# EAGLE design working (EAGLE 9.5.0)
COMPANY: ADAFRUIT INDUSTRIES; DRAWN: KTOWN; REV: A
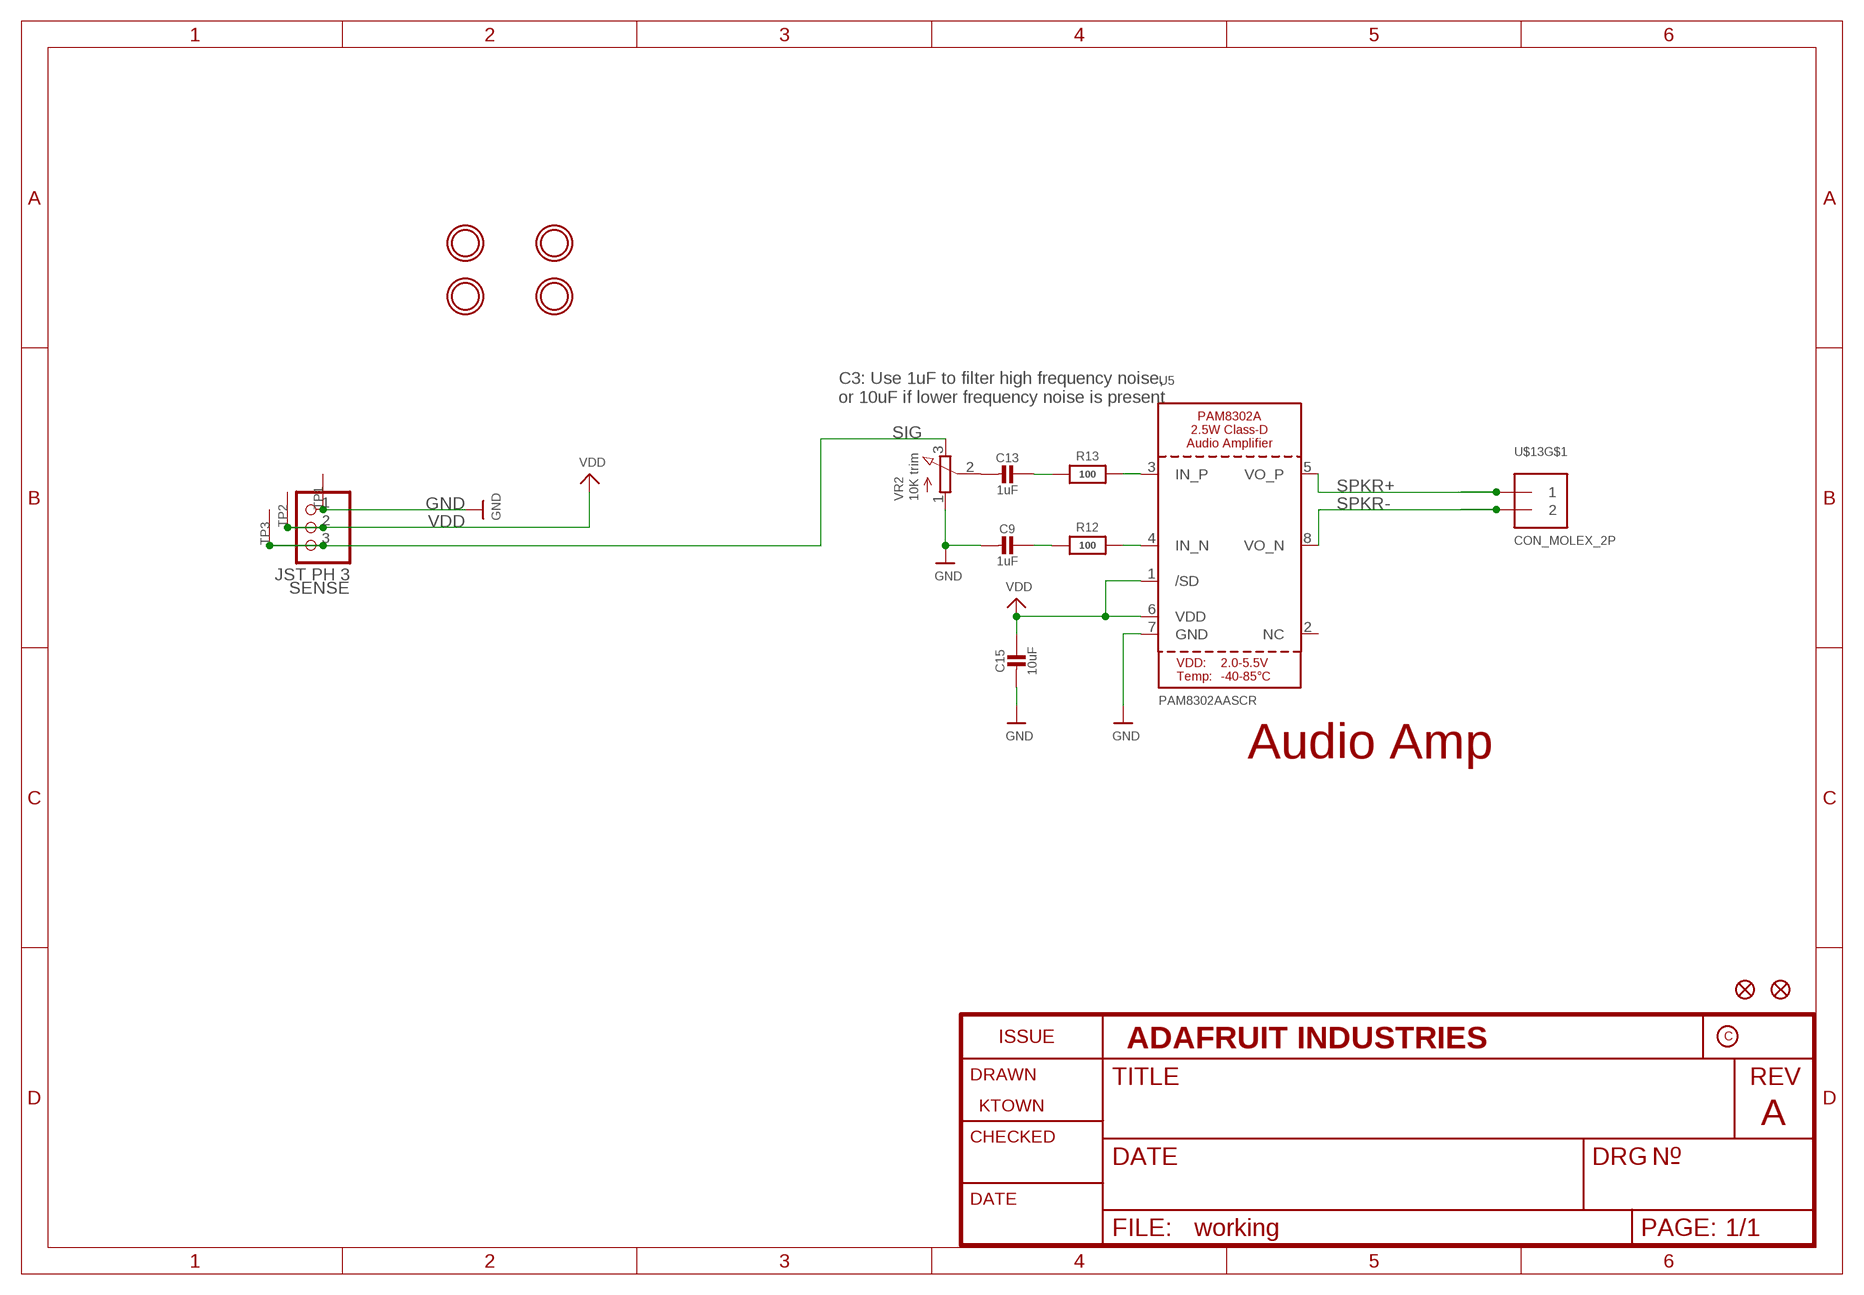
[diagram p0: schematic, sheet 1]

## Parts
C9  1uF  CAP_CERAMIC0603_NO  [0603-NO]
C13  1uF  CAP_CERAMIC0603_NO  [0603-NO]
C15  10uF  CAP_CERAMIC0805-NOOUTLINE  [0805-NO]
FID1  FIDUCIAL_1MM  [FIDUCIAL_1MM]
FID2  FIDUCIAL_1MM  [FIDUCIAL_1MM]
R12  100  RESISTOR_0603_NOOUT  [0603-NO]
R13  100  RESISTOR_0603_NOOUT  [0603-NO]
SENSE  JST PH 3  CON_JST_PH_3PIN  [JSTPH3]
TP1  SEWTAPPCB_ALLIGATOR  [PCB_ALLI]
TP2  SEWTAPPCB_ALLIGATOR  [PCB_ALLI]
TP3  SEWTAPPCB_ALLIGATOR  [PCB_ALLI]
U5  PAM8302AASCR  AUDIOAMP_PAM8302A  [MSOP8_0.65MM]
U$9  MOUNTINGHOLE2.0  [MOUNTINGHOLE_2.0_PLATED]
U$10  MOUNTINGHOLE2.0  [MOUNTINGHOLE_2.0_PLATED]
U$11  MOUNTINGHOLE2.0  [MOUNTINGHOLE_2.0_PLATED]
U$12  MOUNTINGHOLE2.0  [MOUNTINGHOLE_2.0_PLATED]
U$13  CON_MOLEX_2P  [53398-0271]
VR2  10K trim  TRIMPOT3303W/X  [TRIMPOT_BOURNS_3303W]

## Nets
GND: C9.2 C15.2 SENSE.1 TP1.P$1(SEW) U5.7(GND) VR2.1(A)
N$19: R12.2 U5.4(IN_N)
N$20: R13.2 U5.3(IN_P)
N$21: C9.1 R12.1
N$22: C13.1 R13.1
N$23: C13.2 VR2.2(S)
SIG: SENSE.3 TP3.P$1(SEW) VR2.3(E)
SPKR+: U5.5(VO_P) U$13.1
SPKR-: U5.8(VO_N) U$13.2
VDD: C15.1 SENSE.2 TP2.P$1(SEW) U5.1(/SD) U5.6(VDD)
Unconnected: U5.2(NC) U$13.M1(MT) U$13.M2(MT)

## Notes on the sheet
- C3: Use 1uF to filter high frequency noise,
  or 10uF if lower frequency noise is present
- Audio Amp

## Library data of the parts
C9 C13 C15 = microbuilder:CAP_CERAMIC: Ceramic Capacitors For new designs, use the packages preceded by an '_' character since they are more reliable: The following footprints should be used on most boards: _0402 - Standard footprint for regular board layouts _0603 - Standard footprint for regular board layouts _0805 - Standard footprint for regular board layouts _1206 - Standard footprint for regular board layouts For extremely tight-pitch boards where space is at a premium, the following 'micro-pitch' footprints can be used (smaller pads, no silkscreen outline, etc.): _0402MP - Micro-pitch footprint for very dense/compact boards _0603MP - Micro-pitch footprint for very dense/compact boards _0805MP - Micro-pitch footprint for very dense/compact boards _1206MP - Micro-pitch footprint for very dense/compact boards
FID1 FID2 = microbuilder:FIDUCIAL: Fiducial Alignment Points Various fiducial points for machine vision alignment.; BOM: EXCLUDE
R12 R13 = microbuilder:RESISTOR: Resistors For new designs, use the packages preceded by an '_' character since they are more reliable: The following footprints should be used on most boards: _0402 - Standard footprint for regular board layouts _0603 - Standard footprint for regular board layouts _0805 - Standard footprint for regular board layouts _1206 - Standard footprint for regular board layouts For extremely tight-pitch boards where space is at a premium, the following 'micro-pitch' footprints can be used (smaller pads, no silkscreen outline, etc.): _0402MP - Micro-pitch footprint for very dense/compact boards _0603MP - Micro-pitch footprint for very dense/compact boards _0805MP - Micro-pitch footprint for very dense/compact boards _1206MP - Micro-pitch footprint for very dense/compact boards
SENSE = microbuilder:CON_JST_PH_3PIN
TP1-TP3 = microbuilder:SEWTAP
U5 = microbuilder:AUDIOAMP_PAM8302A: PAM8302A - 2.5W Class-D Mono Audio Amplifier MSOP8 = PAM8302AASCR
U$9-U$12 = microbuilder:MOUNTINGHOLE: Mounting Hole For #2 screws (0.086"/2.18mm width, 0.094"/2.4mm hole) use 2.5mm; BOM: EXCLUDE
U$13 = microbuilder:CON_MOLEX_2P
VR2 = microbuilder:TRIMPOT: 3-Pin SMT Trimpots Bourns TC33 (X-2) Series 1K - Digikey: TC33X-102ECT-ND 10K - Digikey: TC33X-2-103E 100K - Digikey: TC33X-104ECT-ND Bourns 3303 (W) Series 3mm 10K Single Turn - Digikey: 3303W-103ETR-ND 3mm 100K Single Turn - Digikey: 3303X-104ETR-ND

## Net classes
1 power: width 0.305 mm

## Board
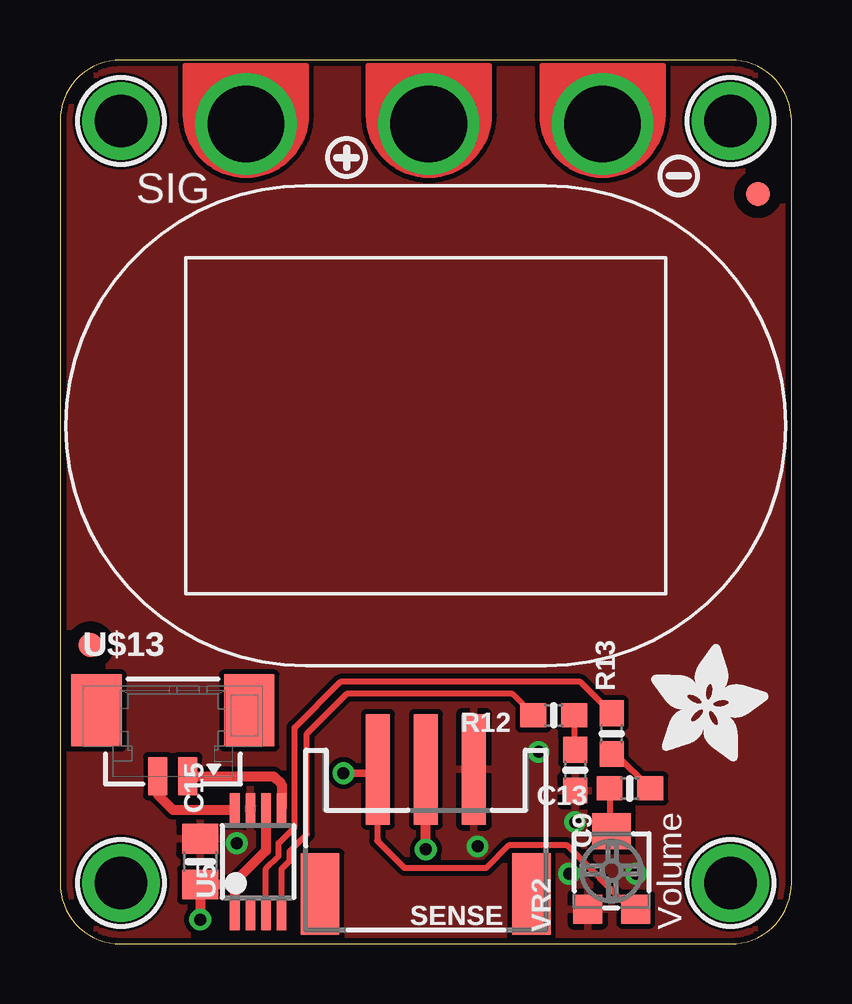
[diagram p1: board, top side]
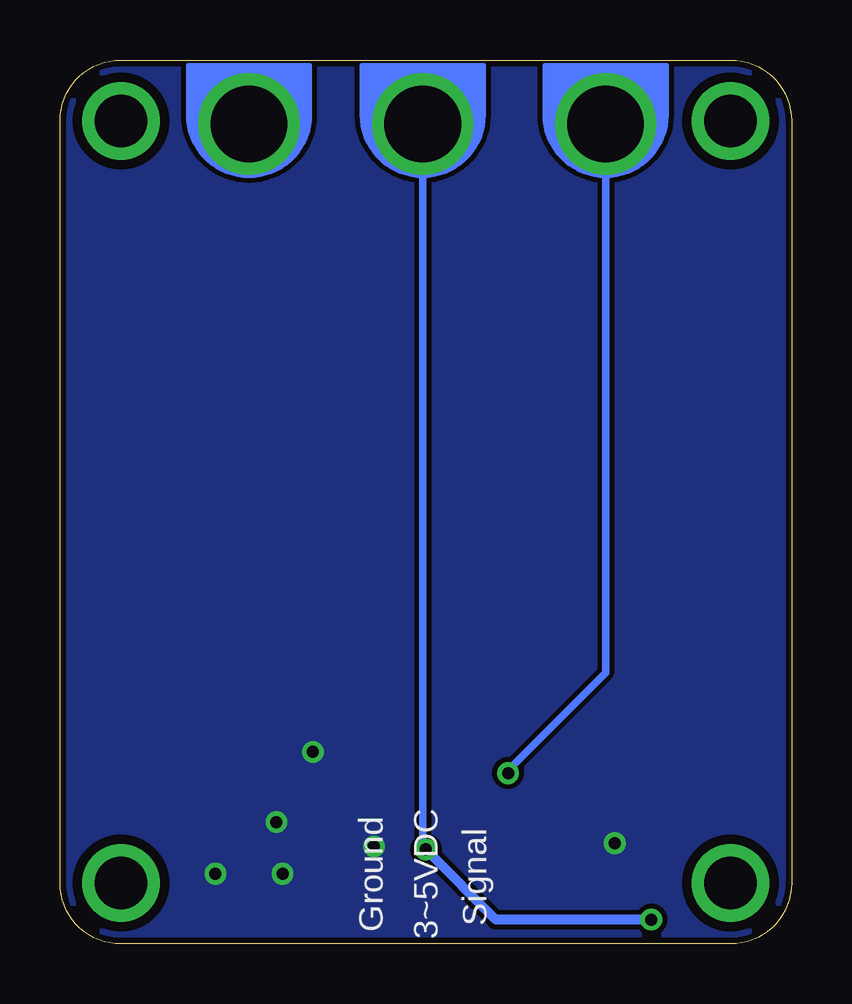
[diagram p2: board, bottom side, seen from below]

Size 30.48 x 36.83 mm. Coordinates in mm from the lower left corner, seen from the top.
Outline: 0,34.29 0,2.54 arc90 2.54,0 27.94,0 arc90 30.48,2.54 30.48,34.29 arc90 27.94,36.83 2.54,36.83 arc90 0,34.29
Copper layers (1*16): Top 0.035mm / dielectric 1.5mm / Bottom 0.035mm
Design rules "adafruit": minimum track width 8mil, minimum drill 15.5mil, track to track 8mil, track to pad 8mil, pad to pad 8mil, via to via 8mil, smd to smd 8mil, copper to edge 10mil, drill to drill 8mil, minimum pad ring 10mil, minimum via ring 8mil, stop-mask expansion 2mil, vias tented up to drill 20mil, thermal gap 10mil

### Footprints (pad centres in the part's own frame; a part is rotated, then mirrored left to right if it is on the bottom)
0603-NO = smd 1.075 x 1: 1 -0.85,0; 2 0.85,0
0805-NO = smd 1.24 x 1.5: 1 -0.95,0; 2 0.95,0
FIDUCIAL_1MM = smd 1 x 1: 1 0,0
JSTPH3 = smd 1 x 4.6: 1 -2,-2.7; 2 0,-2.7; 3 2,-2.7 | smd 1.6 x 3.4: NC1 -4.4,2.5; NC2 4.4,2.5
PCB_ALLI = drill 3.2: P$1 0,0.508
MSOP8_0.65MM = smd 0.4 x 1.3: 1 -0.975,-2.2; 2 -0.325,-2.2; 3 0.325,-2.2; 4 0.975,-2.2; 5 0.975,2.2; 6 0.325,2.2; 7 -0.325,2.2; 8 -0.975,2.2
MOUNTINGHOLE_2.0_PLATED = drill 2.2 pad 3: P$1 0,0
53398-0271 = smd 0.8 x 1.6: 1 0.625,-1.27; 2 -0.625,-1.27 | smd 2.1 x 3: M1 3.185,1.48; M2 -3.185,1.48
TRIMPOT_BOURNS_3303W = smd 1.2 x 1.2: 1 -1,-1.6; 3 1,-1.6 | smd 1.6 x 1.5: 2 0,1.65

### Placement (x,y rotation side)
C9  21.46,7.24 270 top
C13  23.75,6.48 180 top
C15  5.84,3.43 90 top
FID1  29.08,31.24 90 top
FID2  1.27,12.45 90 top
R12  20.57,9.53 180 top
R13  22.99,8.76 90 top
SENSE  15.24,4.57 180 top
TP1  22.61,33.66 0 top
TP2  15.37,33.66 0 top
TP3  7.75,33.66 0 top
U5  8.26,3.43 0 top
U$1  [SPEAKER_OVAL8OHM]  15.24,21.59 180 top
U$3  [ADAFRUIT_5MM]  24.64,7.62 0 top
U$4  [STEMMA_SPEAKER]  30.48,0.38 0 bottom
U$5  [SYMBOL_MINUS]  25.78,32 0 top
U$6  [SYMBOL_PLUS]  11.94,32.77 0 top
U$9  27.94,2.54 0 top
U$10  27.94,34.29 90 top
U$11  2.54,34.29 90 top
U$12  2.54,2.54 0 top
U$13  4.7,8.26 0 top
VR2  22.99,3.05 0 top

### Tracks (layer width: path | path; a pad name or v marks a point on that pad's centre or on a via)
GND  (via drill 0.5)
  other vias: 17.4,4.06 7.37,4.19 19.94,8 21.21,2.92 24,2.92 21.46,5.08
  pour Bottom: 0,36.83 30.48,36.83 30.48,0 0,0
  pour Top: 0,0 30.48,0 30.48,36.83 0,36.83
N$19
  Top 0.254: U5.4 9.23,3.13 9.57,3.47 9.57,3.86 10.29,4.57 10.29,8.76 11.94,10.41 18.84,10.41 R12.2
N$20
  Top 0.254: U5.3 8.58,3.13 9.11,3.66 9.11,4.2 9.78,4.86 9.78,9.02 11.68,10.92 21.68,10.92 R13.2
N$21
  Top 0.254: R12.1 21.42,8.13 C9.1
N$22
  Top 0.254: R13.1 23.16,7.91 C13.1
N$23
  Top 0.254: C13.2 22.9,4.79 VR2.2
SIG  (via drill 0.5)
  Top 0.254: VR2.3 23.79,1.45 21.14,4.1 18.7,4.1 17.75,3.15 14.37,3.15 13.21,4.32 13.24,4.35 13.24,7.11 SENSE.3
  Top 0.305: v11.81,7.11 13.24,7.11
  Bottom 0.305: TP3.P$1 7.75,11.3 11.94,7.11 v11.81,7.11
SPKR+
  Top 0.406: U$13.1 8.89,6.99 9.23,6.64 U5.5
SPKR-
  Top 0.406: U$13.2 4.07,6.21 4.7,5.59 7.24,5.59 U5.8
VDD  (via drill 0.5)
  Top 0.406: U5.6 8.58,3.88 7.28,2.58 | 7.28,2.58 U5.1 | 7.28,2.58 7.18,2.48 C15.1 v5.84,1.02 | v15.24,3.94 SENSE.2
  Bottom 0.305: TP2.P$1 15.37,4.06 15.11,3.81
  Bottom 0.406: v5.84,1.02 12.32,1.02 15.11,3.81 v15.24,3.94

### Text on the board
tPlace: SIG | Volume
bPlace: Signal | 3~5VDC | Ground